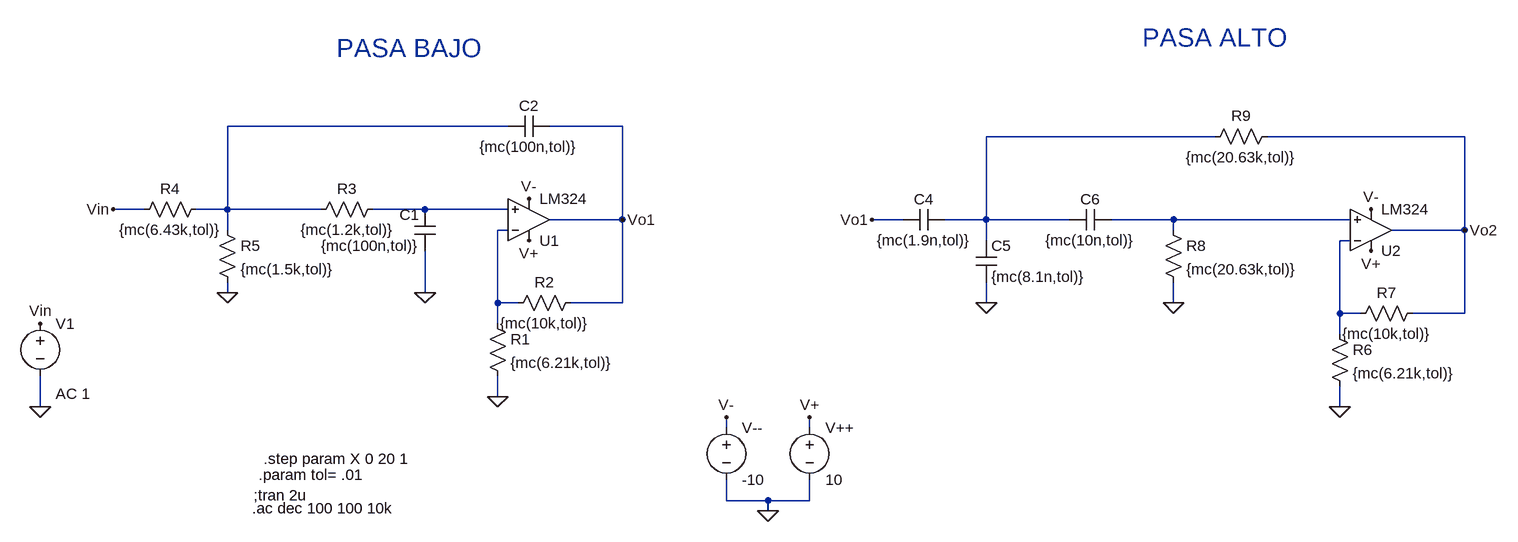
[diagram p0: schematic Lab4Circ1.asc]
Lab4Circ1.asc, the LTspice schematic file:
Version 4
SHEET 1 2140 680
WIRE 512 32 80 32
WIRE 688 32 576 32
WIRE 1600 48 1248 48
WIRE 1984 48 1680 48
WIRE -48 160 -96 160
WIRE 80 160 80 32
WIRE 80 160 32 160
WIRE 224 160 80 160
WIRE 384 160 304 160
WIRE 512 160 384 160
WIRE 688 176 688 32
WIRE 688 176 576 176
WIRE 1120 176 1072 176
WIRE 1248 176 1248 48
WIRE 1248 176 1184 176
WIRE 1376 176 1248 176
WIRE 1536 176 1440 176
WIRE 1808 176 1536 176
WIRE 80 192 80 160
WIRE 512 192 496 192
WIRE 1536 192 1536 176
WIRE 1984 192 1984 48
WIRE 1984 192 1872 192
WIRE 1248 208 1248 176
WIRE 1808 208 1792 208
WIRE 80 288 80 272
WIRE 384 288 384 224
WIRE 496 304 496 192
WIRE 528 304 496 304
WIRE 688 304 688 176
WIRE 688 304 608 304
WIRE 1248 304 1248 272
WIRE 1536 304 1536 272
WIRE 1792 320 1792 208
WIRE 1824 320 1792 320
WIRE 1984 320 1984 192
WIRE 1984 320 1904 320
WIRE 496 336 496 304
WIRE 1792 352 1792 320
WIRE 496 448 496 416
WIRE -208 464 -208 416
WIRE 1792 464 1792 432
WIRE 848 496 848 480
WIRE 976 496 976 480
WIRE 848 608 848 576
WIRE 912 608 848 608
WIRE 976 608 976 576
WIRE 976 608 912 608
WIRE 912 624 912 608
FLAG 912 624 0
FLAG 976 480 V+
FLAG 544 208 V+
FLAG 848 480 V-
FLAG 544 144 V-
FLAG -208 464 0
FLAG -208 336 Vin
FLAG 688 176 Vo1
FLAG 496 448 0
FLAG 384 288 0
FLAG 80 288 0
FLAG -96 160 Vin
FLAG 1840 224 V+
FLAG 1840 160 V-
FLAG 1984 192 Vo2
FLAG 1792 464 0
FLAG 1536 304 0
FLAG 1248 304 0
FLAG 1072 176 Vo1
SYMBOL LM324 544 240 M180
SYMATTR InstName U1
SYMBOL voltage 976 480 R0
WINDOW 123 0 0 Left 0
WINDOW 39 24 124 Left 2
SYMATTR InstName V++
SYMATTR Value 10
SYMBOL voltage 848 480 R0
WINDOW 123 0 0 Left 0
WINDOW 39 24 124 Left 2
SYMATTR InstName V--
SYMATTR Value -10
SYMBOL voltage -208 320 R0
WINDOW 123 24 124 Left 2
WINDOW 39 24 124 Left 2
SYMATTR Value2 AC 1
SYMATTR InstName V1
SYMATTR Value ""
SYMBOL res 480 320 R0
SYMATTR InstName R1
SYMATTR Value {mc(6.21k,tol)}
SYMBOL res 624 288 R90
WINDOW 0 0 56 VBottom 2
WINDOW 3 32 56 VTop 2
SYMATTR InstName R2
SYMATTR Value {mc(10k,tol)}
SYMBOL cap 400 224 R180
WINDOW 0 24 56 Left 2
WINDOW 3 24 8 Left 2
SYMATTR InstName C1
SYMATTR Value {mc(100n,tol)}
SYMBOL cap 576 16 R90
WINDOW 0 0 32 VBottom 2
WINDOW 3 32 32 VTop 2
SYMATTR InstName C2
SYMATTR Value {mc(100n,tol)}
SYMBOL res 320 144 R90
WINDOW 0 0 56 VBottom 2
WINDOW 3 32 56 VTop 2
SYMATTR InstName R3
SYMATTR Value {mc(1.2k,tol)}
SYMBOL res 48 144 R90
WINDOW 0 0 56 VBottom 2
WINDOW 3 32 56 VTop 2
SYMATTR InstName R4
SYMATTR Value {mc(6.43k,tol)}
SYMBOL res 64 176 R0
SYMATTR InstName R5
SYMATTR Value {mc(1.5k,tol)}
SYMBOL LM324 1840 256 M180
SYMATTR InstName U2
SYMBOL res 1776 336 R0
SYMATTR InstName R6
SYMATTR Value {mc(6.21k,tol)}
SYMBOL res 1920 304 R90
WINDOW 0 0 56 VBottom 2
WINDOW 3 32 56 VTop 2
SYMATTR InstName R7
SYMATTR Value {mc(10k,tol)}
SYMBOL cap 1184 160 R90
WINDOW 0 0 32 VBottom 2
WINDOW 3 32 32 VTop 2
SYMATTR InstName C4
SYMATTR Value {mc(1.9n,tol)}
SYMBOL cap 1232 208 R0
SYMATTR InstName C5
SYMATTR Value {mc(8.1n,tol)}
SYMBOL cap 1440 160 R90
WINDOW 0 0 32 VBottom 2
WINDOW 3 32 32 VTop 2
SYMATTR InstName C6
SYMATTR Value {mc(10n,tol)}
SYMBOL res 1520 176 R0
SYMATTR InstName R8
SYMATTR Value {mc(20.63k,tol)}
SYMBOL res 1696 32 R90
WINDOW 0 0 56 VBottom 2
WINDOW 3 32 56 VTop 2
SYMATTR InstName R9
SYMATTR Value {mc(20.63k,tol)}
TEXT 120 600 Left 2 !;tran 2u
TEXT 118 620 Left 2 !.ac dec 100 100 10k
TEXT 128 568 Left 2 !.param tol= .01
TEXT 136 544 Left 2 !.step param X 0 20 1
TEXT 248 -88 Left 4 ;PASA BAJO
TEXT 1488 -104 Left 4 ;PASA ALTO

The netlist it stands for:
* Lab4Circ1.asc
* U1: LM324 (symbol LM324 not available, pins judged from their places): In+=N003 In-=N005 V+=V+ V-=V- OUT=Vo1
V++ V+ 0 10
V-- V- 0 -10
V1 Vin 0 AC 1
R1 N005 0 {mc(6.21k,tol)}
R2 Vo1 N005 {mc(10k,tol)}
C1 0 N003 {mc(100n,tol)}
C2 Vo1 N001 {mc(100n,tol)}
R3 N003 N001 {mc(1.2k,tol)}
R4 N001 Vin {mc(6.43k,tol)}
R5 N001 0 {mc(1.5k,tol)}
* U2: LM324 (symbol LM324 not available, pins judged from their places): In+=N004 In-=N006 V+=V+ V-=V- OUT=Vo2
R6 N006 0 {mc(6.21k,tol)}
R7 Vo2 N006 {mc(10k,tol)}
C4 N002 Vo1 {mc(1.9n,tol)}
C5 N002 0 {mc(8.1n,tol)}
C6 N004 N002 {mc(10n,tol)}
R8 N004 0 {mc(20.63k,tol)}
R9 Vo2 N002 {mc(20.63k,tol)}
;tran 2u
.ac dec 100 100 10k
.param tol= .01
.step param X 0 20 1
* PASA BAJO
* PASA ALTO
.backanno
.end